# EAGLE schematic 230V2LED (EAGLE 6.2)
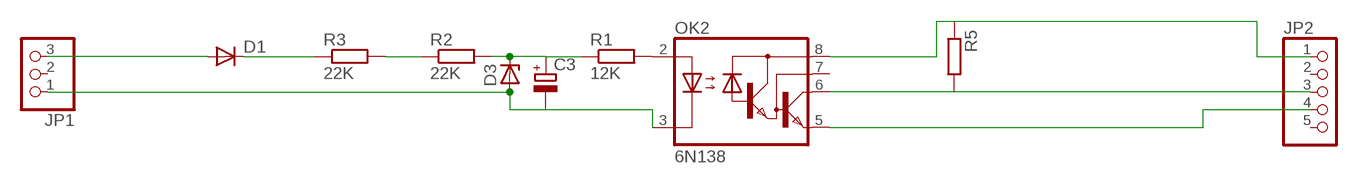
[diagram p0: schematic, sheet 1]

## Parts
C3  CPOL-EUE2,5-6E  [E2,5-6E]
D1  DIODE-D-2.5  [D-2.5]
D3  ZENER-DIODEZD-2.5  [ZDIO-2.5]
JP1  PINHD-1X3  [1X03]
JP2  PINHD-1X5  [1X05]
OK2  6N138  [DIL08]
R1  12K  R-EU_0207/2V  [0207/2V]
R2  22K  R-EU_0207/2V  [0207/2V]
R3  22K  R-EU_0207/2V  [0207/2V]
R5  R-EU_0207/2V  [0207/2V]

## Nets
N$1: JP2.1 OK2.8(VCC) R5.1
N$2: JP2.4 OK2.5(GND)
N$3: JP2.3 OK2.6(VO) R5.2
N$4: D1.C R3.1
N$5: R2.1 R3.2
N$6: OK2.2(A) R1.2
N$8: D1.A JP1.3
N$9: C3.- D3.A JP1.1 OK2.3(C)
N$10: C3.+ D3.C R1.1 R2.2
Unconnected: JP1.2 JP2.2 JP2.5 OK2.7(VB)

## Library data of the parts
C3 = rcl:CPOL-EU: POLARIZED CAPACITOR, European symbol
D1 = diode:DIODE-: DIODE
D3 = diode:ZENER-DIODE: Z-Diode
JP1 = pinhead:PINHD-1X3: PIN HEADER
JP2 = pinhead:PINHD-1X5: PIN HEADER
OK2 = optocoupler:6N138: MOTOROLA OPTO COUPLER; MF: VISHAY/TELEFUNKEN; MPN: 6N138; OC_FARNELL: 9860150; OC_NEWARK: 35K5294
R1-R3 R5 = resistor:R-EU_: RESISTOR, European symbol